# Altium schematic sheet BoostConverter.SchDoc
size A4
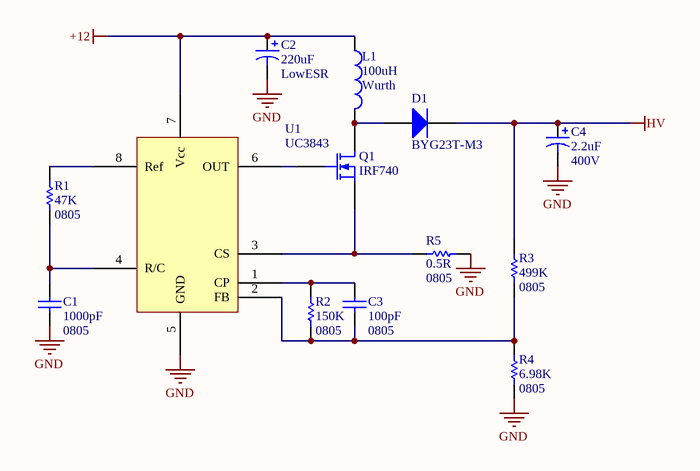
[diagram p0: BoostConverter.SchDoc]

## Parts
C1  1000pF  value 0805  [6-0805_N]
C2  220uF  value LowESR  [CapacitorxNichicon]
C3  100pF  value 0805  [6-0805_N]
C4  2.2uF  value 400V  [CAP_UCD_10X10_NCH]
D1  BYG23T-M3  [DIODE_SMA_DO-214AC_VIS]
L1  100uH  value Wurth  [inductor12mm]
Q1  IRF740  [D2PAK_L]
R1  47K  value 0805  [6-0805_N]
R2  150K  value 0805  [6-0805_N]
R3  499K  value 0805  [6-0805_N]
R4  6.98K  value 0805  [6-0805_N]
R5  0.5R  value 0805  [6-0805_N]
U1  UC3843  [UC3843BD1]

## Nets
+12: C2.1 L1.1 U1.7(Vcc)
GND: C1.1 C2.2 C4.2 R4.1 R5.1 U1.5(GND)
HV: C4.1 D1.2(K) R3.2
NetC1_2: C1.2 R1.1 U1.4(R/C)
NetC3_1: C3.1 R2.1 R3.1 R4.2 U1.2(FB)
NetC3_2: C3.2 R2.2 U1.1(CP)
NetD1_1: D1.1(A) L1.2 Q1.1(D)
NetQ1_2: Q1.2(G) U1.6(OUT)
NetQ1_3: Q1.3(S) R5.2 U1.3(CS)
NetR1_2: R1.2 U1.8(Ref)

## Library data of the parts
C1 C3 = Cap: Capacitor; Published: 8-Jun-2000; LatestRevisionDate: 17-Jul-2002; LatestRevisionNote: Re-released for DXP Platform.; PackageReference: RAD-0.3; Publisher: Altium Limited; PackageDescription: Radial Cap, Thru-Hole; 2 Leads; 0.3 in Pin Spacing
C2 = Cap Pol1: Polarized Capacitor (Radial); pin to pad: 1>2 2>1; Published: 8-Jun-2000; LatestRevisionDate: 17-Jul-2002; LatestRevisionNote: Re-released for DXP Platform.; PackageReference: RB7.6-15; Publisher: Altium Limited; PackageDescription: Polarized Capacitor (Radial); 2 Leads; Supplier 1: Digi-Key
C4 = Cap Pol1: Polarized Capacitor (Radial); Published: 8-Jun-2000; LatestRevisionDate: 17-Jul-2002; LatestRevisionNote: Re-released for DXP Platform.; PackageReference: RB7.6-15; Publisher: Altium Limited; PackageDescription: Polarized Capacitor (Radial); 2 Leads; Supplier 1: Digi-Key; Supplier Part Number 1: 493-9969-1-ND
D1 = Diode: Default Diode; pin to pad: 1>2 2>1; Published: 8-Jun-2000; LatestRevisionDate: 17-Jul-2002; LatestRevisionNote: Re-released for DXP Platform.; PackageVersion: Sep-1996; PackageReference: SMC; Publisher: Altium Limited; PackageDescription: DO-214-AB/SMC; 2 C-Bend Leads; Body 7.9 x 5.9 mm, inc. leads (LxW); Code_JEDEC: DO-214-AB; Supplier 1: Digi-Key; Supplier Part Number 1: BYG23T-M3/CT-ND
L1 = Inductor: Code_IEC: 1005; Published: 8-Jun-2000; LatestRevisionDate: 29-May-2009; LatestRevisionNote: IPC-7351 Footprint Added.; PackageReference: 0402-A; Publisher: Altium Limited; PackageDescription: Chip Inductor; Code_JEITA: 0402; Supplier 1: Digi-Key; Supplier Part Number 1: 732-1235-1-ND
Q1 = MOSFET-N: N-Channel MOSFET; pin to pad: 1>2 2>1; Published: 8-Jun-2000; LatestRevisionDate: 17-Jul-2002; LatestRevisionNote: Re-released for DXP Platform.; PackageVersion: 1995/1996; PackageReference: E3; Publisher: Altium Limited; PackageDescription: TO, Flat Index; 3 In-Line, Axial Leads; Body Dia. 4.6mm; Lead Dia. 0.5 mm (max); Supplier 1: Digi-Key; Supplier Part Number 1: IRF740SPBF-ND
R1-R5 = Res1: Resistor; Published: 8-Jun-2000; LatestRevisionDate: 17-Jul-2002; LatestRevisionNote: Re-released for DXP Platform.; PackageReference: AXIAL-0.3; Publisher: Altium Limited; PackageDescription: Axial Device, Thru-Hole; 2 Leads; 0.3 in Pin Spacing